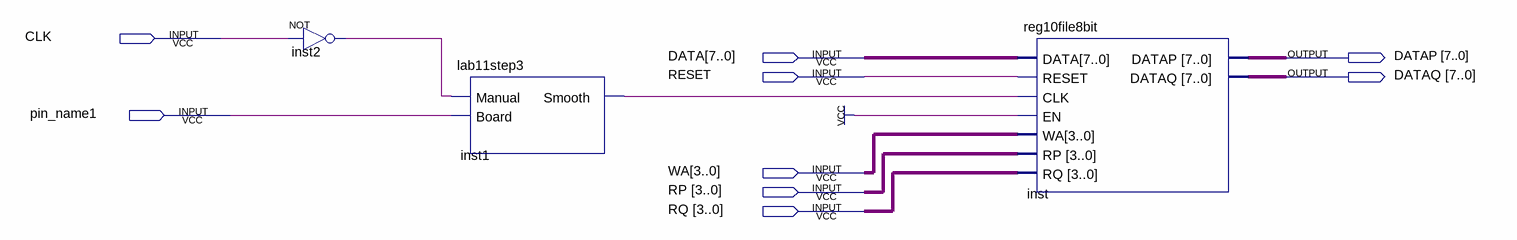
[diagram p0: schematic sheet]
// Quartus schematic regtest.bdf as structural Verilog: 3 symbols, 9 pins
module regtest (
  input  CLK,
  input  [7:0] DATA,
  input  RESET,
  input  pin_name1,
  input  [3:0] WA,
  input  [3:0] RP,
  input  [3:0] RQ,
  output [7:0] DATAP,
  output [7:0] DATAQ
);

  wire inst1_smooth, inst2_out;

  not inst2 (inst2_out, CLK);
  lab11step3 inst1 (.Manual(inst2_out), .Board(pin_name1), .Smooth(inst1_smooth));
  reg10file8bit inst (
    .DATA(DATA), .RESET(RESET), .CLK(inst1_smooth), .EN(1'b1), .WA(WA), .RP(RP), .RQ(RQ), .DATAP(DATAP),
    .DATAQ(DATAQ));
endmodule
